# Altium project PCB_ESL_RX_V2.PrjPcb
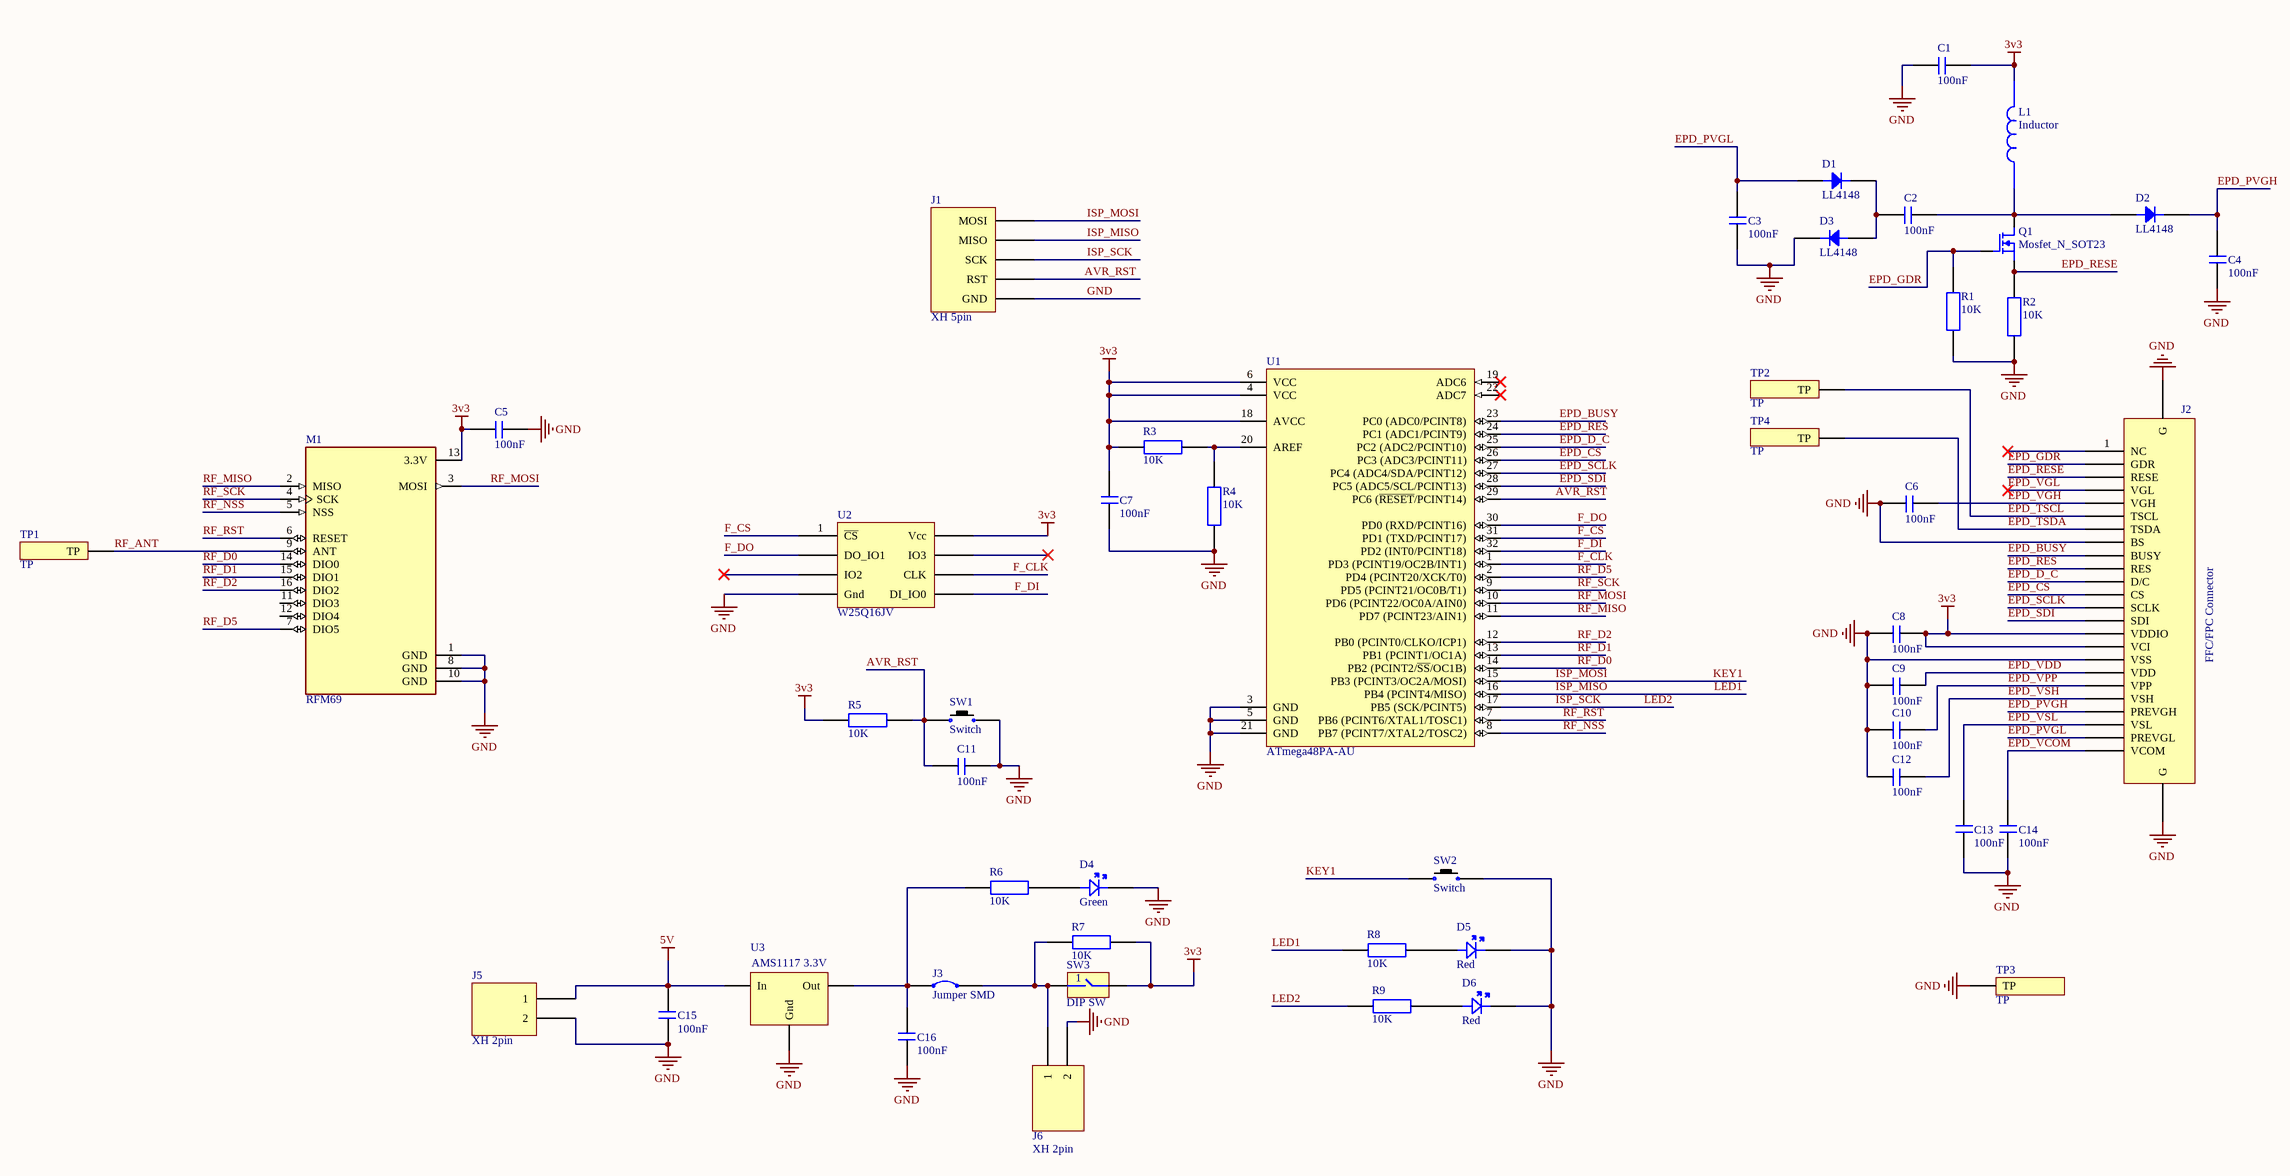
[diagram p0: RX_Sheet1.SchDoc]
1 sheet, 49 parts. Net scope: global (net labels, ports and power ports of the same name join across sheets).
Board file: RX_PCB1.PcbDoc

## Sheet RX_Sheet1.SchDoc
size A2

### Parts
C1  100nF  [CAP_0805]
C2  100nF  [CAP_0805]
C3  100nF  [CAP_0805]
C4  100nF  [CAP_0805]
C5  100nF  [CAP_0805]
C6  100nF  [CAP_0805]
C7  100nF  [CAP_0805]
C8  100nF  [CAP_0805]
C9  100nF  [CAP_0805]
C10  100nF  [CAP_0805]
C11  100nF  [CAP_0805]
C12  100nF  [CAP_0805]
C13  100nF  [CAP_0805]
C14  100nF  [CAP_0805]
C15  100nF  [CAP_0805]
C16  100nF  [CAP_0805]
D1  LL4148  [LL4148]
D2  LL4148  [LL4148]
D3  LL4148  [LL4148]
D4  Green  [LED_0805_Green]
D5  Red  [LED_0805_Red]
D6  Red  [LED_0805_Red]
J1  XH 5pin  [XH-5pin]
J2  FFC/FPC Connector  [EPD_CON_24]
J3  Jumper SMD  [Jumper_smd]  (no BOM)
J5  XH 2pin  [XH-2pin]
J6  XH 2pin  [XH-2pin]
L1  Inductor  [L_5x5]
M1  RFM69  [RFM95W]
Q1  Mosfet_N_SOT23  [SOT23 - N-Channel - duplicate]
R1  10K  [RES_0805]
R2  10K  [RES_0805]
R3  10K  [RES_0805]
R4  10K  [RES_0805]
R5  10K  [RES_0805]
R6  10K  [RES_0805]
R7  10K  [RES_0805]
R8  10K  [RES_0805]
R9  10K  [RES_0805]
SW1  Switch  [Tact_SW_SMD]
SW2  Switch  [Tact_SW_SMD]
SW3  DIP SW  [DIP_SW_1key]
TP1  TP  [TP]  (no BOM)
TP2  TP  [TP]  (no BOM)
TP3  TP  [TP]  (no BOM)
TP4  TP  [TP]  (no BOM)
U1  ATmega48PA-AU  [32A_M]
U2  W25Q16JV  [W25Q64]
U3  AMS1117 3.3V  [AMS1117-SOT223]

### Nets
3v3: C1.2 C5.1 C7.2 C8.2 J2.15(VDDIO) J2.16(VCI) L1.2 M1.13(3.3V) R3.1 R5.1 R7.2 SW3.2 U1.4(VCC) U1.6(VCC) U1.18(AVCC) U2.8(Vcc)
5V: C15.1 J5.1 U3.1(In)
GND: C1.1 C3.1 C4.1 C5.2 C6.1 C7.1 C8.1 C9.1 C10.1 C11.2 C12.1 C13.1 C14.1 C15.2 C16.2 D3.K D4.2 D5.2 D6.2 J1.5(GND) J2.8(BS) J2.17(VSS) J2.25(G) J2.26(G) J5.2 J6.2 M1.1(GND) M1.8(GND) M1.10(GND) R1.1 R2.1 R4.1 SW1.1 SW2.1 TP3.1(TP) U1.3(GND) U1.5(GND) U1.21(GND) U2.4(Gnd) U3.2(Gnd)
AVR_RST: C11.1 J1.4(RST) R5.2 SW1.2 U1.29(PC6_(~{RESET}/PCINT14))
EPD_BUSY: J2.9(BUSY) U1.23(PC0_(ADC0/PCINT8))
EPD_CS: J2.12(CS) U1.26(PC3_(ADC3/PCINT11))
EPD_D_C: J2.11(D/C) U1.25(PC2_(ADC2/PCINT10))
EPD_GDR: J2.2(GDR) Q1.G R1.2
EPD_PVGH: C4.2 D2.K J2.21(PREVGH)
EPD_PVGL: C3.2 D1.A J2.23(PREVGL)
EPD_RES: J2.10(RES) U1.24(PC1_(ADC1/PCINT9))
EPD_RESE: J2.3(RESE) Q1.S R2.2
EPD_SCLK: J2.13(SCLK) U1.27(PC4_(ADC4/SDA/PCINT12))
EPD_SDI: J2.14(SDI) U1.28(PC5_(ADC5/SCL/PCINT13))
EPD_TSCL: J2.6(TSCL) TP2.1(TP)
EPD_TSDA: J2.7(TSDA) TP4.1(TP)
EPD_VCOM: C14.2 J2.24(VCOM)
EPD_VDD: C9.2 J2.18(VDD)
EPD_VGH: C6.2 J2.5(VGH)
EPD_VGL: J2.4(VGL)
EPD_VPP: C10.2 J2.19(VPP)
EPD_VSH: C12.2 J2.20(VSH)
EPD_VSL: C13.2 J2.22(VSL)
F_CLK: U1.1(PD3_(PCINT19/OC2B/INT1)) U2.6(CLK)
F_CS: U1.31(PD1_(TXD/PCINT17)) U2.1(~{CS})
F_DI: U1.32(PD2_(INT0/PCINT18)) U2.5(DI_IO0)
F_DO: U1.30(PD0_(RXD/PCINT16)) U2.2(DO_IO1)
ISP_MISO: J1.2(MISO) R8.1 U1.16(PB4_(PCINT4/MISO))  [also labelled LED1]
ISP_MOSI: J1.1(MOSI) SW2.2 U1.15(PB3_(PCINT3/OC2A/MOSI))  [also labelled KEY1]
ISP_SCK: J1.3(SCK) R9.1 U1.17(PB5_(SCK/PCINT5))  [also labelled LED2]
RF_ANT: M1.9(ANT) TP1.1(TP)
RF_D0: M1.14(DIO0) U1.14(PB2_(PCINT2/~{SS}/OC1B))
RF_D1: M1.15(DIO1) U1.13(PB1_(PCINT1/OC1A))
RF_D2: M1.16(DIO2) U1.12(PB0_(PCINT0/CLKO/ICP1))
RF_D5: M1.7(DIO5) U1.2(PD4_(PCINT20/XCK/T0))
RF_MISO: M1.2(MISO) U1.11(PD7_(PCINT23/AIN1))
RF_MOSI: M1.3(MOSI) U1.10(PD6_(PCINT22/OC0A/AIN0))
RF_NSS: M1.5(NSS) U1.8(PB7_(PCINT7/XTAL2/TOSC2))
RF_RST: M1.6(RESET) U1.7(PB6_(PCINT6/XTAL1/TOSC1))
RF_SCK: M1.4(SCK) U1.9(PD5_(PCINT21/OC0B/T1))
NetC2_1: C2.1 D1.K D3.A
NetC2_2: C2.2 D2.A L1.1 Q1.D
NetC16_1: C16.1 J3.2 R6.1 U3.3(Out)
NetD4_1: D4.1 R6.2
NetD5_1: D5.1 R8.2
NetD6_1: D6.1 R9.2
NetJ3_1: J3.1 J6.1 R7.1 SW3.1
NetR3_2: R3.2 R4.2 U1.20(AREF)

Not connected (* = marked no-connect by the designer): J2 1(NC)*; M1 11(DIO3) 12(DIO4); U1 19(ADC6)* 22(ADC7)*; U2 3(IO2)* 7(IO3)*

### Library data of the parts
C1-C16 = Cap0805: Capacitor SMD 0805
D1-D3 = Diode_LL4148: Diode SMD LL4148 1206
D4 = LED_0805_Green: LED SMD 0805 Green
D5 D6 = LED_0805_Red: LED SMD 0805 Red
J1 = Con_XH_5pin: Connector XH Female 5-pin
J2 = EPD_con_24pin
J3 = Jump_smd
J5 J6 = Con_XH_2pin: Connector XH Female 2-pin
L1 = Inductor_5x5: SMD Power Inductor 10X10mm
M1 = RFM95W-915S2: General ISM < 1GHz LoRaâ„¢ Transceiver Module 915MHz Surface Mount; pin to pad: 1>GND 2>MISO 3>MOSI 4>SCK 5>NSS 6>RESET 7>DIO5 8>GND 9>ANT 10>GND 11>DIO3 12>DIO4 13>3V3 14>DIO0 15>DIO1 16>DIO2; MF: RF Solutions; Availability: Unavailable; SnapEDA_Link: https://www.snapeda.com/parts/RFM95W-915S2/RF%20Solutions/view-part/585488/?ref=snap; MP: RFM95W-915S2; Price: None; Value: *; Package: SMD-16 RF Solutions
Q1 = Mosfet_N_SOT23: MOSFET N-Channel SMD SOT23
R1-R9 = Res0805: Resistor SMD 0805
SW1 SW2 = Tact_sw: Tact switch SMD 2pin
SW3 = DIP_SW_1: DIP Swtich 1 key
TP1-TP4 = TP: Test point
U1 = ATmega48PA-AU: 8-bit AVR Microcontroller, 4KB Flash, 256 Bytes EEPROM, 512 Bytes SRAM, 32-pin TQFP, Industrial Grade (-40°C to 85°C); Published: 1-Apr-2010; DatasheetVersion: revA, Jan-2010; PackageVersion: revB, Oct-2001; PackageReference: 32A; Publisher: Altium Limited; PackageDescription: 32-Lead, 7x7x1.0 mm Body, 0.8mm Lead Pitch, Thin Profile Plastic Quad Flat Package (TQFP); Supplier 1: Digi-Key; Supplier Part Number 1: ATMEGA48PA-AU-ND; Supplier 2: Farnell; Supplier Part Number 2: 1715488; Supplier 3: Mouser; Supplier Part Number 3: 556-ATMEGA48PA-AU; Code_JEDEC: MS-026-ABA; ComponentLink1Description: Manufacturer Link; ComponentLink1URL: http://www.atmel.com/products/avr/default.asp?; ComponentLink2Description: ATmega48A/48PA/88A/88PA/168A/168PA/328/328P Datasheet; ComponentLink2URL: http://www.atmel.com/dyn/resources/prod_documents/8271.pdf; ComponentLink3Description: ATmega48A/48PA/88A/88PA/168A/168PA/328/328P Summary; ComponentLink3URL: http://www.atmel.com/dyn/resources/prod_documents/8271S.pdf; ComponentLink4Description: Atmel.com Home; ComponentLink4URL: http://www.atmel.com
U2 = W25Q64JV: Serial Flash Memory 64Mbit
U3 = AMS1117-SOT223: AMS1117 Regulator 3.3V SMD SOT223; pin to pad: 1>In 2>Gnd_Adj 3>Out